# Altium project PCB_Project1.PrjPCB
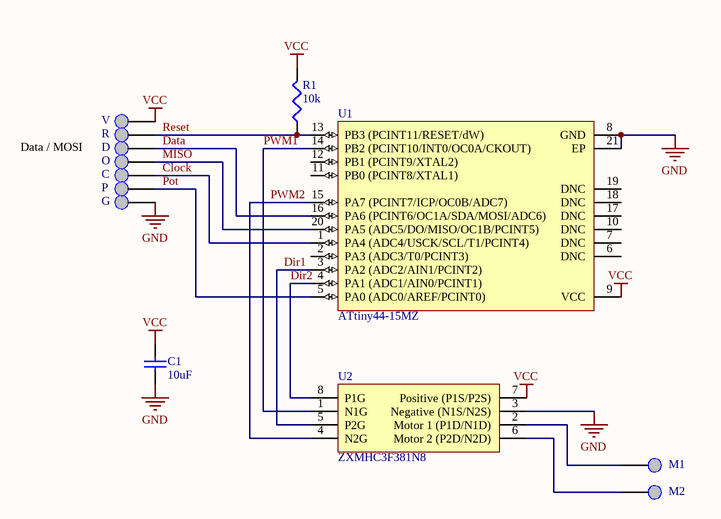
[diagram p0: Servo.SchDoc]
1 sheet, 13 parts. Net scope: global (net labels, ports and power ports of the same name join across sheets).
Board file: PCB1.PcbDoc

## Sheet Servo.SchDoc
size A

### Parts
C  Test Point  [TestPoint]  (value not drawn)
C1  value 10uF  [0805]  (hidden comment: CapSMD)
D  Test Point  [TestPoint]  (value not drawn)
G  Test Point  [TestPoint]  (value not drawn)
M1  Test Point  [TestPoint]  (value not drawn)
M2  Test Point  [TestPoint]  (value not drawn)
O  Test Point  [TestPoint]  (value not drawn)
P  Test Point  [TestPoint]  (value not drawn)
R  Test Point  [TestPoint]  (value not drawn)
R1  value 10k  [RESC1608L]  (hidden comment: ResSMD)
U1  ATtiny44-15MZ  [20M1_N]
U2  ZXMHC3F381N8  [SOIC8_N]
V  Test Point  [TestPoint]  (value not drawn)

### Nets
GND: C1.1 G.1 U1.8(GND) U1.21(EP) U2.3(Negative_(N1S/N2S))
VCC: C1.2 R1.2 U1.9(VCC) U2.7(Positive_(P1S/P2S)) V.1
Clock: C.1 U1.1(PA4_(ADC4/USCK/SCL/T1/PCINT4))
Data: D.1 U1.16(PA6_(PCINT6/OC1A/SDA/MOSI/ADC6))
Dir1: U1.3(PA2_(ADC2/AIN1/PCINT2)) U2.5(P2G)
Dir2: U1.4(PA1_(ADC1/AIN0/PCINT1)) U2.8(P1G)
MISO: O.1 U1.20(PA5_(ADC5/DO/MISO/OC1B/PCINT5))
Pot: P.1 U1.5(PA0_(ADC0/AREF/PCINT0))
PWM1: U1.14(PB2_(PCINT10/INT0/OC0A/CKOUT)) U2.1(N1G)
PWM2: U1.15(PA7_(PCINT7/ICP/OC0B/ADC7)) U2.4(N2G)
Reset: R.1 R1.1 U1.13(PB3_(PCINT11/RESET/dW))
NetM1_1: M1.1 U2.2(Motor_1_(P1D/N1D))
NetM2_1: M2.1 U2.6(Motor_2_(P2D/N2D))

Not connected (* = marked no-connect by the designer): U1 2(PA3_(ADC3/T0/PCINT3)) 6(DNC) 7(DNC) 10(DNC) 11(PB0_(PCINT8/XTAL1)) 12(PB1_(PCINT9/XTAL2)) 17(DNC) 18(DNC) 19(DNC)

### Notes on the sheet
- Data / MOSI

### Library data of the parts
C1 = CapSMD: Capacitor; PackageDescription: Chip Capacitor
R1 = ResSMD: Resistor; PackageDescription: Chip Resistor
U1 = ATtiny44-15MZ: 8-bit Automotive AVR Microcontroller, 4KB Flash, 256 Bytes EEPROM, 256 Bytes SRAM, Automotive Grade (-40° to +125°C), 20-Pin VQFN; Published: 1-Apr-2010; DatasheetVersion: revB, Sep-2007; PackageVersion: revG, Jul-2007; PackageReference: 20PC; Publisher: Altium Limited; PackageDescription: 20-Lead, 4 x 4 x 0.8 mm Body, 0.50 mm Pitch, Quad Flat No-Lead Package (QFN); Supplier 1: Digi-Key; Supplier Part Number 1: ATTINY44-15MZ-ND; Supplier 2: Mouser; Supplier Part Number 2: 556-ATTINY44-15MZ; Code_JEDEC: MO-220WGGD-5; ComponentLink1Description: Manufacturer Link; ComponentLink1URL: http://www.atmel.com/products/avr/default.asp?; ComponentLink2Description: ATtiny24/44/84 Datasheet; ComponentLink2URL: http://www.atmel.com/dyn/resources/prod_documents/doc7701.pdf; ComponentLink3Description: Atmel.com Home; ComponentLink3URL: http://www.atmel.com
U2 = ZXMHC3F381N8TC: Power Driver ICs MOSFET H-BRIDGE SOP-8L; Manufacturer: Diodes Inc. / Zetex; Output Voltage: 30 V; Supply Current: 2 A, -2 A; Fall Time: 6.3 ns; Maximum Power Dissipation: 0.87 W; Maximum Turn-Off Delay Time: 11.5 ns; Maximum Turn-On Delay Time: 2.5 ns; Number of Drivers: 4; Rise Time: 3.3 ns; Supply Voltage - Max: 30 V, - 30 V; Supplier 1: Mouser; Manufacturer Part Number: ZXMHC3F381N8TC; RoHS: RoHS Compliant; Category: Power Driver ICs; Stock 1: 2936; Pricing 1: 1=1.14, 10=1.02, 100=0.705, 500=0.630, 1000=0.495, 2500=0.420, 5000=0.399, 10000=0.383, 25000=0.372 (USD); Configuration: H-Bridge; Package / Case: SOIC-8; Packaging: Reel; Product: H-Bridge Drivers; Type: H-Bridge; Mounting Style: SMD/SMT; Maximum Operating Temperature: + 150 C; Minimum Operating Temperature: - 55 C; Product Category: MOSFETs; RoHS - Mouser: Y; Minimum Order Quantity: 1; Reeling: True; ComponentLink1URL: http://www.mouser.com/ds/1/115/ZXMHC3F381N8-42504.pdf; ComponentLink1Description: http://www.mouser.com/ds/1/115/ZXMHC3F381N8-42504.pdf; Supplier 2: Digi-Key; Supplier 3: Farnell; Supplier Part Number 1: 522-ZXMHC3F381N8TC; Supplier Part Number 2: ZXMHC3F381N8DIDKR-ND; Supplier Part Number 3: 2061507